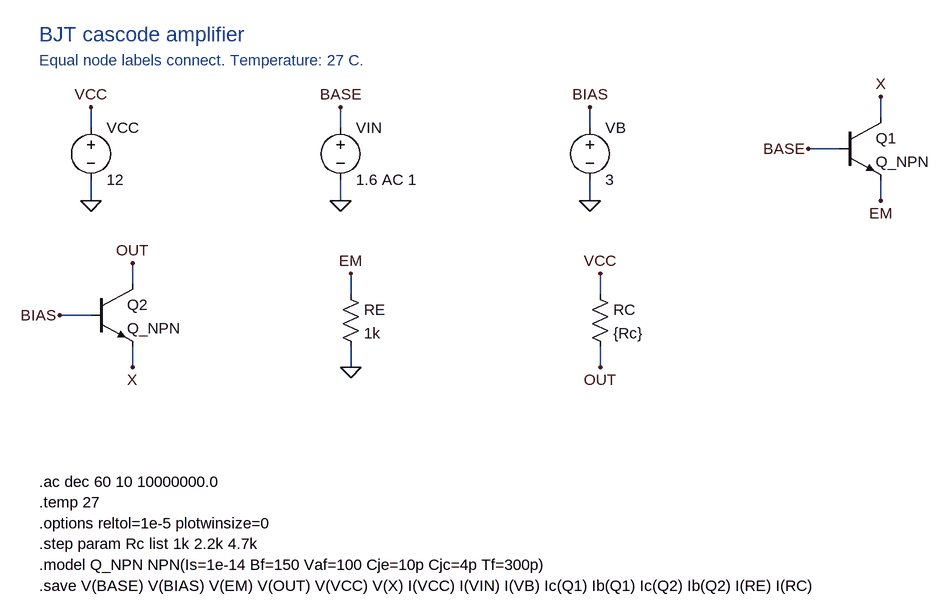
[diagram p0: schematic bjt-cascode-amplifier.asc]
bjt-cascode-amplifier.asc, the LTspice schematic file:
Version 4
SHEET 1 1740 1032
WIRE 144 176 144 144
WIRE 144 256 144 288
WIRE 528 176 528 144
WIRE 528 256 528 288
WIRE 912 176 912 144
WIRE 912 256 912 288
WIRE 1360 160 1360 128
WIRE 1296 208 1248 208
WIRE 1360 256 1360 288
WIRE 208 416 208 384
WIRE 144 464 96 464
WIRE 208 512 208 544
WIRE 544 432 544 400
WIRE 544 512 544 544
WIRE 928 432 928 400
WIRE 928 512 928 544
FLAG 144 144 VCC
FLAG 144 288 0
FLAG 528 144 BASE
FLAG 528 288 0
FLAG 912 144 BIAS
FLAG 912 288 0
FLAG 1360 128 X
FLAG 1248 208 BASE
FLAG 1360 288 EM
FLAG 208 384 OUT
FLAG 96 464 BIAS
FLAG 208 544 X
FLAG 544 400 EM
FLAG 544 544 0
FLAG 928 400 VCC
FLAG 928 544 OUT
SYMBOL voltage 144 160 R0
SYMATTR InstName VCC
SYMATTR Value 12
SYMBOL voltage 528 160 R0
SYMATTR InstName VIN
SYMATTR Value 1.6 AC 1
SYMBOL voltage 912 160 R0
SYMATTR InstName VB
SYMATTR Value 3
SYMBOL npn 1296 160 R0
SYMATTR InstName Q1
SYMATTR Value Q_NPN
SYMBOL npn 144 416 R0
SYMATTR InstName Q2
SYMATTR Value Q_NPN
SYMBOL res 528 416 R0
SYMATTR InstName RE
SYMATTR Value 1k
SYMBOL res 912 416 R0
SYMATTR InstName RC
SYMATTR Value {Rc}
TEXT 64 32 Left 3 ;BJT cascode amplifier
TEXT 64 72 Left 2 ;Equal node labels connect. Temperature: 27 C.
TEXT 64 720 Left 2 !.ac dec 60 10 10000000.0
TEXT 64 752 Left 2 !.temp 27
TEXT 64 784 Left 2 !.options reltol=1e-5 plotwinsize=0
TEXT 64 816 Left 2 !.step param Rc list 1k 2.2k 4.7k
TEXT 64 848 Left 2 !.model Q_NPN NPN(Is=1e-14 Bf=150 Vaf=100 Cje=10p Cjc=4p Tf=300p)
TEXT 64 880 Left 2 !.save V(BASE) V(BIAS) V(EM) V(OUT) V(VCC) V(X) I(VCC) I(VIN) I(VB) Ic(Q1) Ib(Q1) Ic(Q2) Ib(Q2) I(RE) I(RC)

The netlist it stands for:
* bjt-cascode-amplifier.asc
VCC VCC 0 12
VIN BASE 0 1.6 AC 1
VB BIAS 0 3
Q1 X BASE EM 0 Q_NPN
Q2 OUT BIAS X 0 Q_NPN
RE EM 0 1k
RC VCC OUT {Rc}
.model NPN NPN
.model PNP PNP
.lib standard.bjt
* BJT cascode amplifier
* Equal node labels connect. Temperature: 27 C.
.ac dec 60 10 10000000.0
.temp 27
.options reltol=1e-5 plotwinsize=0
.step param Rc list 1k 2.2k 4.7k
.model Q_NPN NPN(Is=1e-14 Bf=150 Vaf=100 Cje=10p Cjc=4p Tf=300p)
.save V(BASE) V(BIAS) V(EM) V(OUT) V(VCC) V(X) I(VCC) I(VIN) I(VB) Ic(Q1) Ib(Q1) Ic(Q2) Ib(Q2) I(RE) I(RC)
.backanno
.end